# EAGLE design IN14_board (EAGLE 7.5.0)
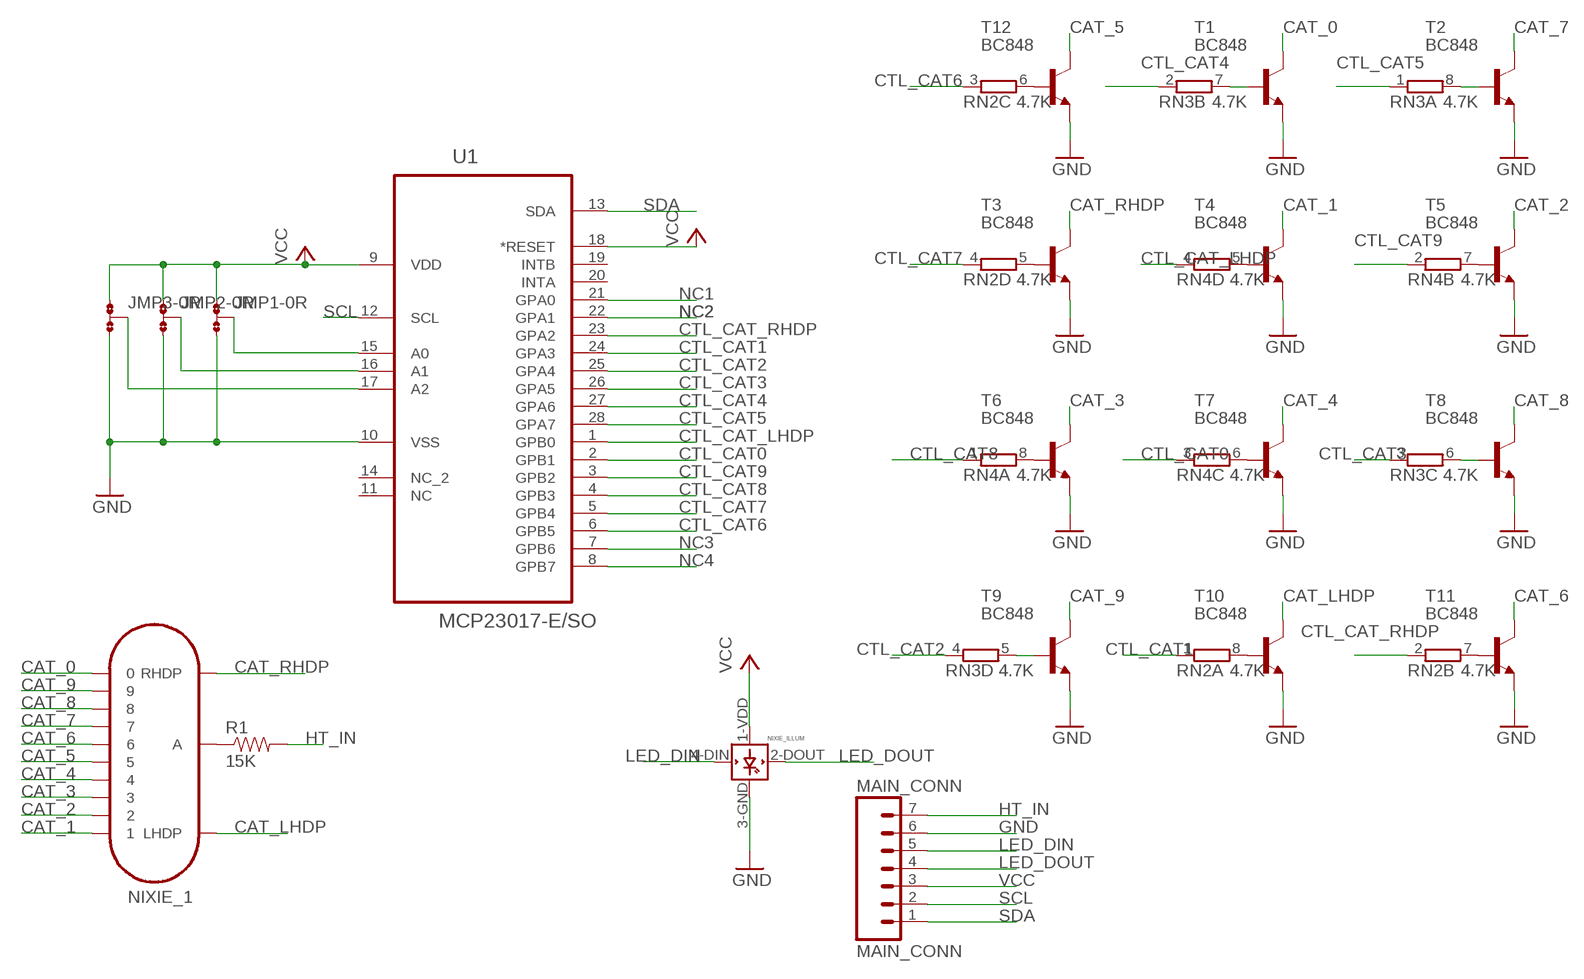
[diagram p0: schematic, sheet 1]

## Parts
JMP1  0R-JUMPA  [A0R-JMP]
JMP2  0R-JUMPA  [A0R-JMP]
JMP3  0R-JUMPA  [A0R-JMP]
MAIN_CONN  MAIN_CONN  M07LONGPADS  [1X07_LONGPADS]
NIXIE_1  IN-14  [IN-14]
NIXIE_ILLUM  WS2812B  [WS2812B]
R1  15K  15KOHM1/10W1%(0603)0603  [0603-RES]
RN2  4.7K  4R-NEXB38V  [EXB38V]
RN3  4.7K  4R-NEXB38V  [EXB38V]
RN4  4.7K  4R-NEXB38V  [EXB38V]
T1  BC848  [SOT23]
T2  BC848  [SOT23]
T3  BC848  [SOT23]
T4  BC848  [SOT23]
T5  BC848  [SOT23]
T6  BC848  [SOT23]
T7  BC848  [SOT23]
T8  BC848  [SOT23]
T9  BC848  [SOT23]
T10  BC848  [SOT23]
T11  BC848  [SOT23]
T12  BC848  [SOT23]
U1  MCP23017-E/SO  [SOIC127P1032X265-28N]

## Nets
CAT_0: NIXIE_1.0 T1.3(C)
CAT_1: NIXIE_1.1 T4.3(C)
CAT_2: NIXIE_1.2 T5.3(C)
CAT_3: NIXIE_1.3 T6.3(C)
CAT_4: NIXIE_1.4 T7.3(C)
CAT_5: NIXIE_1.5 T12.3(C)
CAT_6: NIXIE_1.6 T11.3(C)
CAT_7: NIXIE_1.7 T2.3(C)
CAT_8: NIXIE_1.8 T8.3(C)
CAT_9: NIXIE_1.9 T9.3(C)
CAT_LHDP: NIXIE_1.LHDP T10.3(C)
CAT_RHDP: NIXIE_1.RHDP T3.3(C)
CTL_CAT0: RN4.3 U1.2(GPB1)
CTL_CAT1: RN2.1 U1.24(GPA3)
CTL_CAT2: RN3.4 U1.25(GPA4)
CTL_CAT3: RN3.3 U1.26(GPA5)
CTL_CAT4: RN3.2 U1.27(GPA6)
CTL_CAT5: RN3.1 U1.28(GPA7)
CTL_CAT6: RN2.3 U1.6(GPB5)
CTL_CAT7: RN2.4 U1.5(GPB4)
CTL_CAT8: RN4.1 U1.4(GPB3)
CTL_CAT9: RN4.2 U1.3(GPB2)
CTL_CAT_LHDP: RN4.4 U1.1(GPB0)
CTL_CAT_RHDP: RN2.2 U1.23(GPA2)
GND: JMP1.3 JMP2.3 JMP3.3 MAIN_CONN.6 NIXIE_ILLUM.3-GND(GND) T1.2(E) T2.2(E) T3.2(E) T4.2(E) T5.2(E) T6.2(E) T7.2(E) T8.2(E) T9.2(E) T10.2(E) T11.2(E) T12.2(E) U1.10(VSS)
HT_IN: MAIN_CONN.7 R1.2
LED_DIN: MAIN_CONN.5 NIXIE_ILLUM.4-DIN(DIN)
LED_DOUT: MAIN_CONN.4 NIXIE_ILLUM.2-DOUT(DOUT)
N$1: RN3.8 T2.1(B)
N$2: JMP1.2 U1.15(A0)
N$3: RN3.7 T1.1(B)
N$4: NIXIE_1.A R1.1
N$5: RN3.6 T8.1(B)
N$6: JMP2.2 U1.16(A1)
N$7: RN2.5 T3.1(B)
N$8: JMP3.2 U1.17(A2)
N$9: RN4.5 T4.1(B)
N$10: RN4.8 T6.1(B)
N$11: RN3.5 T9.1(B)
N$12: RN4.7 T5.1(B)
N$13: RN4.6 T7.1(B)
N$14: RN2.6 T12.1(B)
N$15: RN2.7 T11.1(B)
N$16: RN2.8 T10.1(B)
NC1: U1.21(GPA0)
NC2: U1.22(GPA1)
NC3: U1.7(GPB6)
NC4: U1.8(GPB7)
SCL: MAIN_CONN.2 U1.12(SCL)
SDA: MAIN_CONN.1 U1.13(SDA)
VCC: JMP1.1 JMP2.1 JMP3.1 MAIN_CONN.3 NIXIE_ILLUM.1-VDD(VDD) U1.9(VDD) U1.18(*RESET)
Unconnected: U1.11(NC) U1.14(NC_2) U1.19(INTB) U1.20(INTA)

## Library data of the parts
JMP1-JMP3 = jump-0r-smd:0R-JUMP: SMD 0R 0805 Jumper
MAIN_CONN = SparkFun-Connectors:M07: Header 7 Standard 7-pin 0.1" header. Use with straight break away headers (SKU : PRT-00116), right angle break away headers (PRT-00553), swiss pins (PRT-00743), machine pins (PRT-00117), and female headers (PRT-00115). NOTES ON THE VARIANTS LOCK and LOCK_LONGPADS... This footprint was designed to help hold the alignment of a through-hole component (i.e. 7-pin header) while soldering it into place. You may notice that each hole has been shifted either up or down by 0.005 of an inch from it's more standard position (which is usually a perfectly straight line). This slight alteration caused the pins (the squares in the middle) to touch the edges of the holes. Because they are alternating, it causes a "brace" to hold the header in place. 0.005 has proven to be the perfect amount of "off-center" position when using our standard breakaway headers. Although looks a little odd when you look at the bare footprint, once you have a header in there, the alteration is very hard to notice. Also, if you push a header all the way into place, it is covered up entirely on the bottom side. This idea of altering the position of holes to aid alignment will be further integrated into the Sparkfun Library for other footprints. It can help hold any component with 3 or more connection pins.
NIXIE_1 = russian-nixies:IN-14: IN-14: medium numeric frontview nixie tube
NIXIE_ILLUM = adafruit:WS2812B
R1 = SparkFun-Resistors:15KOHM1/10W1%(0603): RES-07854; PROD_ID: RES-07854
RN2-RN4 = resistor-dil:4R-N: Array Chip Resistor Source: RS Component / Phycomp; OC_FARNELL: unknown; OC_NEWARK: unknown
T1-T12 = transistor:BC848: NPN TRANSISTOR
U1 = MCP23017:MCP23017-E/SO: IC, 16-Bit I/O Expander with Serial Interface, SOIC-28; MPN: MCP23017-E/SO; OC_FARNELL: 1332087; OC_NEWARK: 34M7442; PACKAGE: SOIC-28; SUPPLIER: Microchip

## Board
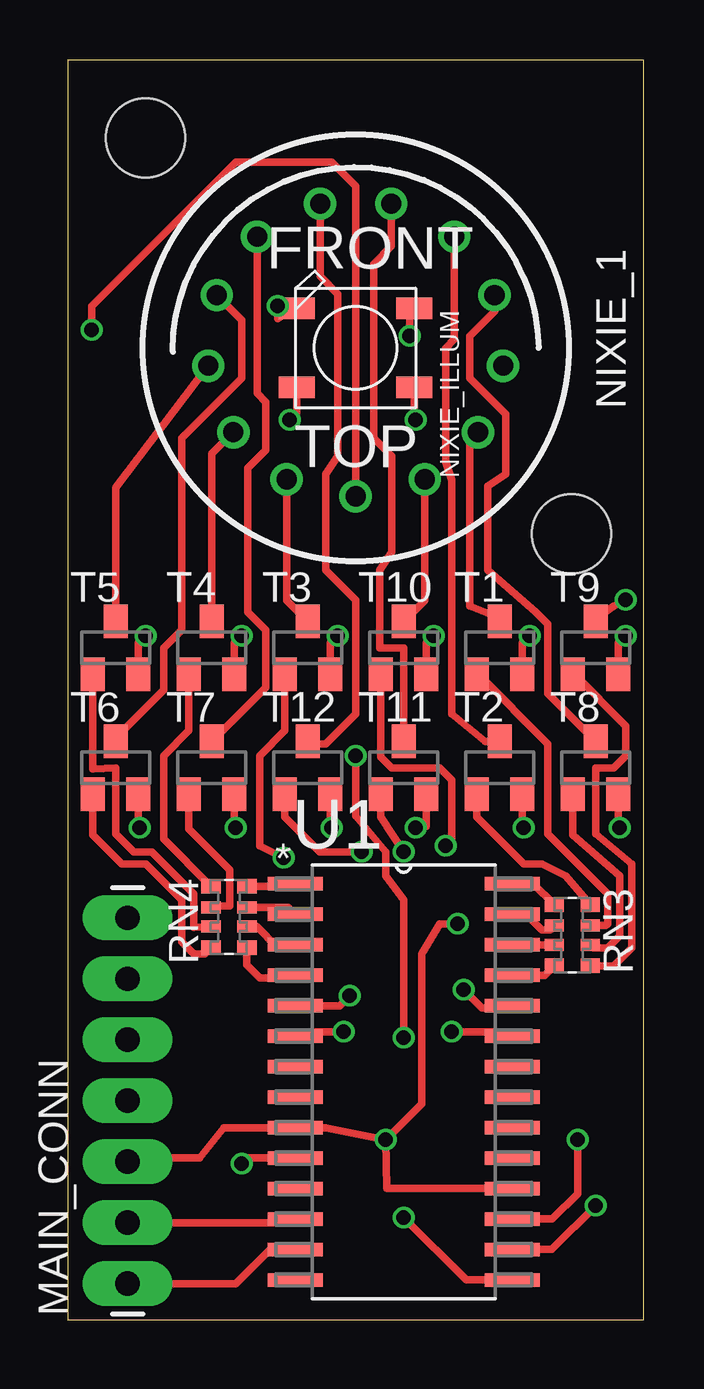
[diagram p1: board, top side]
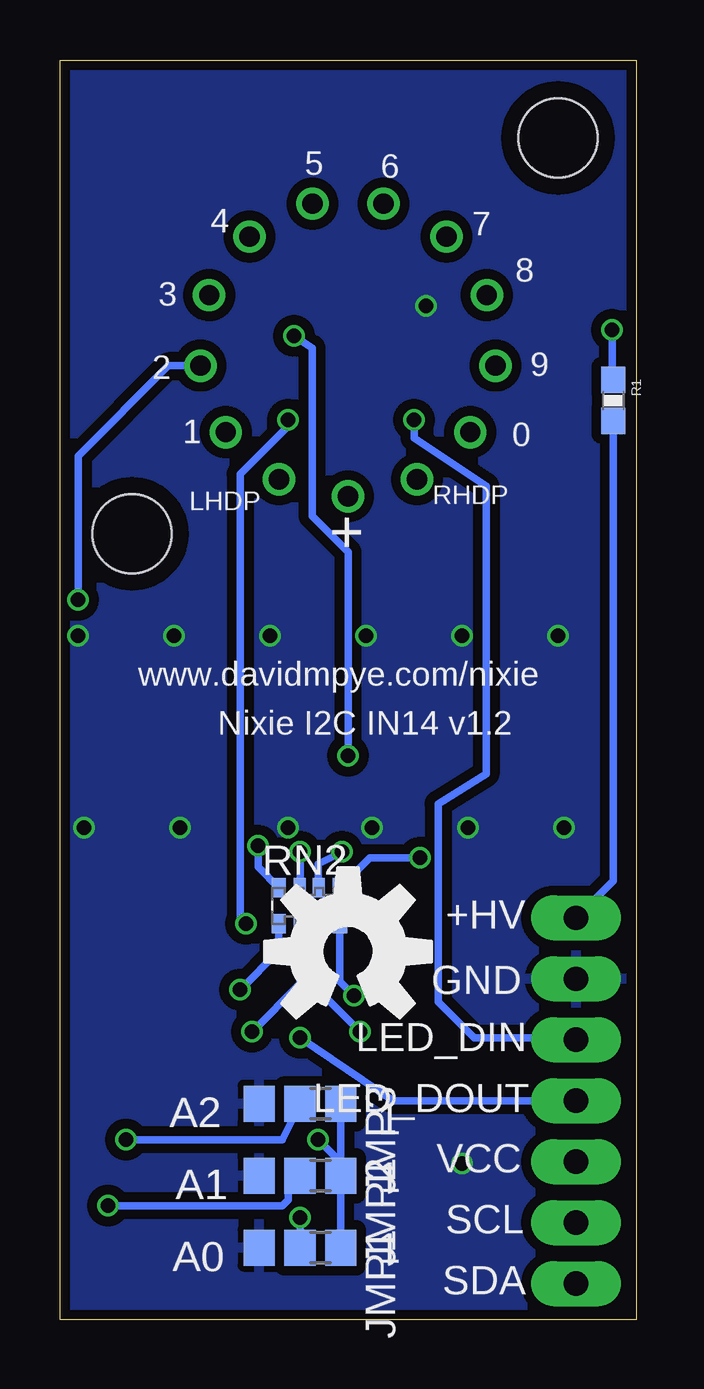
[diagram p2: board, bottom side, seen from below]

Size 24 x 52.5 mm. Coordinates in mm from the lower left corner, seen from the top.
Outline: 0,0 24,0 24,52.5 0,52.5 0,0
Copper layers (1*16): Top 0.035mm / dielectric 1.5mm / Bottom 0.035mm
Design rules "dirt_cheap_dirty_boards.v1": minimum track width 5mil, minimum drill 12mil, track to track 5mil, track to pad 5mil, pad to pad 5mil, via to via 5mil, smd to smd 0mil, copper to edge 10mil, drill to drill 10mil, minimum pad ring 10mil, minimum via ring 6mil, stop-mask expansion 2mil, vias tented up to drill 25mil, thermal gap 10mil

### Footprints (pad centres in the part's own frame; a part is rotated, then mirrored left to right if it is on the bottom)
A0R-JMP = smd 1.5 x 1.3: 1 0,1.7; 2 0,0; 3 0,-1.7
1X07_LONGPADS = drill 1.016 pad 1.88 long: 1 0,0; 2 2.54,0; 3 5.08,0; 4 7.62,0; 5 10.16,0; 6 12.7,0; 7 15.24,0
IN-14 = drill 0.84: 0 5.094,-3.516; 1 -5.094,-3.516; 2 -6.145,-0.746; 3 -5.788,2.195; 4 -4.105,4.633; 5 -1.481,6.01; 6 1.481,6.01; 7 4.105,4.633; 8 5.788,2.195; 9 6.145,-0.746; A 0,-6.19; LHDP 2.877,-5.481; RHDP -2.877,-5.481
WS2812B = smd 1.5 x 0.9: 1-VDD 2.45,-1.65; 2-DOUT 2.45,1.65; 3-GND -2.45,1.65; 4-DIN -2.45,-1.65
0603-RES = smd 1.1 x 1: 1 -0.85,0; 2 0.85,0
EXB38V = smd 0.6 x 0.8: 1 -1.275,-0.75; 4 1.275,-0.75; 5 1.275,0.75; 8 -1.275,0.75 | smd 0.5 x 0.8: 2 -0.4,-0.75; 3 0.4,-0.75; 6 0.4,0.75; 7 -0.4,0.75
SOT23 = smd 1 x 1.4: 1 -0.95,-1.1; 2 0.95,-1.1; 3 0,1.1
SOIC127P1032X265-28N = smd 2.286 x 0.559: 1 -4.521,8.255; 2 -4.521,6.985; 3 -4.521,5.715; 4 -4.521,4.445; 5 -4.521,3.175; 6 -4.521,1.905; 7 -4.521,0.635; 8 -4.521,-0.635; 9 -4.521,-1.905; 10 -4.521,-3.175; 11 -4.521,-4.445; 12 -4.521,-5.715; 13 -4.521,-6.985; 14 -4.521,-8.255; 15 4.521,-8.255; 16 4.521,-6.985; 17 4.521,-5.715; 18 4.521,-4.445; 19 4.521,-3.175; 20 4.521,-1.905; 21 4.521,-0.635; 22 4.521,0.635; 23 4.521,1.905; 24 4.521,3.175; 25 4.521,4.445; 26 4.521,5.715; 27 4.521,6.985; 28 4.521,8.255
STAND-OFF = hole 3.302: 0,0

### Placement (x,y rotation side)
JMP1  14,3 270 bottom
JMP2  14,6 270 bottom
JMP3  14,9 270 bottom
MAIN_CONN  2.5,1.5 90 top
NIXIE_1  12,40.5 0 top
NIXIE_ILLUM  12,40.5 0 top
R1  0.95,38.31 270 bottom
RN2  13.61,17.25 0 bottom
RN3  21.02,16.02 270 top
RN4  6.72,16.78 90 top
T1  18,28 0 top
T2  18,23 0 top
T3  10,28 0 top
T4  6,28 0 top
T5  2,28 0 top
T6  2,23 0 top
T7  6,23 0 top
T8  22,23 0 top
T9  22,28 0 top
T10  14,28 0 top
T11  14,23 0 top
T12  10,23 0 top
U1  14,9.9 0 top
U$1  [OSHW-LOGO-L]  12,15.34 0 bottom
U$2  [STAND-OFF]  3.25,49.25 0 top
U$5  [STAND-OFF]  21,32.75 0 top

### Tracks (layer width: path | path; a pad name or v marks a point on that pad's centre or on a via)
CAT_0
  Top 0.305: T1.3 18,29.25 16.75,29.75 16.75,36.6 NIXIE_1.0
CAT_1
  Top 0.305: T4.3 6,36.1 NIXIE_1.1
CAT_2
  Top 0.305: T5.3 2,34.67 NIXIE_1.2
CAT_3
  Top 0.305: T6.3 2,24.25 4,26.25 4,28 4.75,28.75 4.75,36.75 7.25,39.25 7.25,41.66 NIXIE_1.3
CAT_4
  Top 0.305: NIXIE_1.4 7.89,38.6 8.25,38.25 8.25,36.25 7.5,35.5 7.5,29.5 8.25,28.75 8.25,26.35 T7.3
CAT_5
  Top 0.305: NIXIE_1.5 10.52,43.48 11.25,42.75 11.25,36 10.75,35.25 10.75,31.25 12,30 12,25.25 10.75,24 10.02,24 T12.3
CAT_6
  Top 0.305: T11.3 14,28 13,28 13,31.25 13.5,32 13.5,36 12.75,36.75 12.75,44 13.48,44.73 NIXIE_1.6
CAT_7
  Top 0.305: NIXIE_1.7 16.11,40.85 15.75,40.5 15.75,35.75 16,35 16,25.25 17.4,24.1 T2.3
CAT_8
  Top 0.305: NIXIE_1.8 17.79,42.04 16.75,41 16.75,39.25 18.25,37.75 18.25,35.25 17.5,34.75 17.5,31.25 19.5,29.5 20,29 20,26.1 T8.3
CAT_9  (via drill 0.6)
  Top 0.305: v23.25,30 22.75,29.75 22.4,29.5 T9.3
  Bottom 0.305: NIXIE_1.9 19.5,39.75 23.25,36 v23.25,30
CAT_LHDP
  Top 0.305: NIXIE_1.LHDP 14.88,29.98 T10.3
CAT_RHDP
  Top 0.305: NIXIE_1.RHDP 9.12,29.98 T3.3
CTL_CAT0
  Top 0.305: RN4.3 9.19,17.18 U1.2
CTL_CAT1  (via drill 0.6)
  Top 0.305: v16.5,13.75 17.25,13 18.44,13 U1.24
  Bottom 0.305: RN2.1 14.88,15.37 v16.5,13.75
CTL_CAT2
  Top 0.305: U1.25 19.88,14.35 RN3.4
CTL_CAT3
  Top 0.305: U1.26 | RN3.3 19.37,15.62 19.25,15.5 18.64,15.5 U1.26
CTL_CAT4
  Top 0.305: U1.27 19.11,16.89 19.75,16.25 20.1,16.25 RN3.2
CTL_CAT5
  Top 0.305: U1.28 19.41,18.16 RN3.1
CTL_CAT6  (via drill 0.6)
  Top 0.305: v11.5,12 9.67,12 U1.6
  Bottom 0.305: RN2.3 13.21,13.71 v11.5,12
CTL_CAT7  (via drill 0.6)
  Top 0.305: v11.75,13.5 11.33,13.08 U1.5
  Bottom 0.305: RN2.4 12.33,14.08 v11.75,13.5
CTL_CAT8
  Top 0.305: RN4.1 7.47,14.78 8,14.25 9.38,14.25 U1.4
CTL_CAT9
  Top 0.305: RN4.2 7.87,16.38 8.75,15.5 9.36,15.5 U1.3
CTL_CAT_LHDP
  Top 0.305: RN4.4 9.37,18.05 U1.1
CTL_CAT_RHDP  (via drill 0.6)
  Top 0.305: v16,12 18.33,12 U1.23
  Bottom 0.305: RN2.2 14.01,13.99 v16,12
GND  (via drill 0.6)
  Top 0.305: T5.2 2.95,28.2 v3.25,28.5 | T4.2 6.95,28.2 v7.25,28.5 | T3.2 10.95,28.2 v11.25,28.5 | T10.2 14.95,28.2 v15.25,28.5 | T1.2 18.95,28.2 v19.25,28.5 | T9.2 22.95,28.2 v23.25,28.5 | T6.2 2.95,20.55 v3,20.5 | T7.2 6.95,20.55 v7,20.5 | T12.2 10.95,20.55 v11,20.5 | T11.2 14.95,20.55 v14.5,20.5 | T2.2 18.95,20.55 v19,20.5 | T8.2 22.95,20.55 v23,20.5 | v8.75,42.25 8.75,41.72 NIXIE_ILLUM.3-GND | U1.10 7.48,6.73 v7.25,6.5
  pour Bottom (isolate 0.406): 0,52.5 24,52.5 24,0 0,0
HT_IN
  Bottom 0.305: R1.2 0.95,18.29 MAIN_CONN.7
LED_DIN  (via drill 0.6)
  Top 0.305: NIXIE_ILLUM.4-DIN 9.55,37.8 v9.25,37.5
  Bottom 0.305: v9.25,37.5 9.25,36.75 6.25,34.75 6.25,22.75 8.25,21.5 8.25,13.25 6.75,11.75 2.59,11.75 MAIN_CONN.5
LED_DOUT  (via drill 0.6)
  Top 0.305: v14,11.75 14,17.5 13.25,18.5 13.25,19.5 12,21 v12,23.5 | v14.25,41 14.25,42.2 NIXIE_ILLUM.2-DOUT
  Bottom 0.305: MAIN_CONN.4 10.12,9.12 v14,11.75 | v12,23.5 12,32 13.5,33.5 13.5,40.5 v14.25,41
N$1
  Top 0.305: T2.1 17.05,20.95 19,19 19.75,19 20.75,18.5 21.75,17.32 RN3.8
N$2  (via drill 0.6)
  Top 0.305: U1.15 16.6,1.65 v14,4.25
  Bottom 0.305: v14,4.25 JMP1.2
N$3
  Top 0.305: T1.1 17.1,26.9 20,24 20,20.25 22.5,17.75 22.5,16.5 22.42,16.42 RN3.7
N$4  (via drill 0.6)
  Top 0.305: NIXIE_1.A 12,47.25 11,48.25 7,48.25 1,42.25 v1,41.25
  Bottom 0.305: v1,41.25 1,39.21 R1.1
N$5
  Top 0.305: T8.1 21.05,20.2 23,18.5 23,16 22.5,15.5 21.89,15.5 RN3.6
N$6  (via drill 0.6)
  Top 0.305: v22,4.75 20.17,2.92 U1.16
  Bottom 0.305: JMP2.2 14.5,5.5 14.5,5 14.75,4.75 v22,4.75
N$7  (via drill 0.6)
  Top 0.305: T3.1 9.05,24.55 8,23.5 8,19.75 v9,19.25
  Bottom 0.305: v9,19.25 11.08,19.25 RN2.5
N$8  (via drill 0.6)
  Top 0.305: v21.25,7.5 21.25,5.25 20.19,4.19 U1.17
  Bottom 0.305: JMP3.2 14.75,7.5 v21.25,7.5
N$9
  Top 0.305: T4.1 5.05,24.55 4,23.5 4,20.02 RN4.5
N$10
  Top 0.305: T6.1 1.05,20.2 2.25,19 3.25,19 4.75,17.5 4.75,15.75 5.25,15.25 5.71,15.25 RN4.8
N$11
  Top 0.305: T9.1 21.1,26.9 23.25,24.75 23.25,23.5 22.75,23 22,23 22,20.25 23.5,19 23.5,15.5 22.75,14.74 RN3.5
N$12
  Top 0.305: T5.1 1.05,22.95 2,23 2,20.25 2.75,19.5 3.5,19.5 5.25,17.75 5.25,16.35 RN4.7
N$13
  Top 0.305: T7.1 5.05,20.45 6.75,18.75 6.75,17.25 6.04,17.25 RN4.6
N$14  (via drill 0.6)
  Top 0.305: T12.1 9.05,20.95 10.5,19.5 v12.25,19.5
  Bottom 0.305: v12.25,19.5 13.25,19 13.25,18.04 RN2.6
N$15  (via drill 0.6)
  Top 0.305: T11.1 13.05,20.95 v14,19.5
  Bottom 0.305: v14,19.5 RN2.7
N$16  (via drill 0.6)
  Top 0.305: T10.1 13.05,23.45 13.5,23 15.5,23 16,22.5 16,20 v15.75,19.75
  Bottom 0.305: v15.75,19.75 15.75,18.87 RN2.8
SCL
  Top 0.305: MAIN_CONN.2 9.33,4.04 U1.12
SDA
  Top 0.305: MAIN_CONN.1 7,1.5 8.5,3 9.4,3 U1.13
VCC  (via drill 0.6)
  Top 0.305: MAIN_CONN.3 2.67,6.75 5.5,6.75 6.5,8 U1.9 10.75,8 v13.25,7.5 | NIXIE_ILLUM.1-VDD 14.45,37.55 v14.5,37.5 | v16.25,16.5 15.5,16.5 14.75,15.25 14.75,9 v13.25,7.5 | U1.18 13.29,5.46 v13.25,7.5
  Bottom 0.305: JMP3.1 JMP2.1 | JMP1.1 JMP2.1 | v14.5,37.5 14.5,37.25 16.5,35.25 16.5,16.75 v16.25,16.5 | JMP2.1 12.3,6.55 v13.25,7.5

### Text on the board
tPlace: FRONT | TOP
bPlace: 6 | 5 | 7 | 4 | 8 | 3 | 9 | 2 | 1 | 0 | RHDP | LHDP | + | www.davidmpye.com/nixie | Nixie I2C IN14 v1.2 | +HV | GND | LED_DIN | LED_DOUT | 1 | A2 | VCC | 1 | A1 | SCL | 1 | A0 | SDA